# EAGLE board DCC-command-center-V2 (EAGLE 7.4.0)
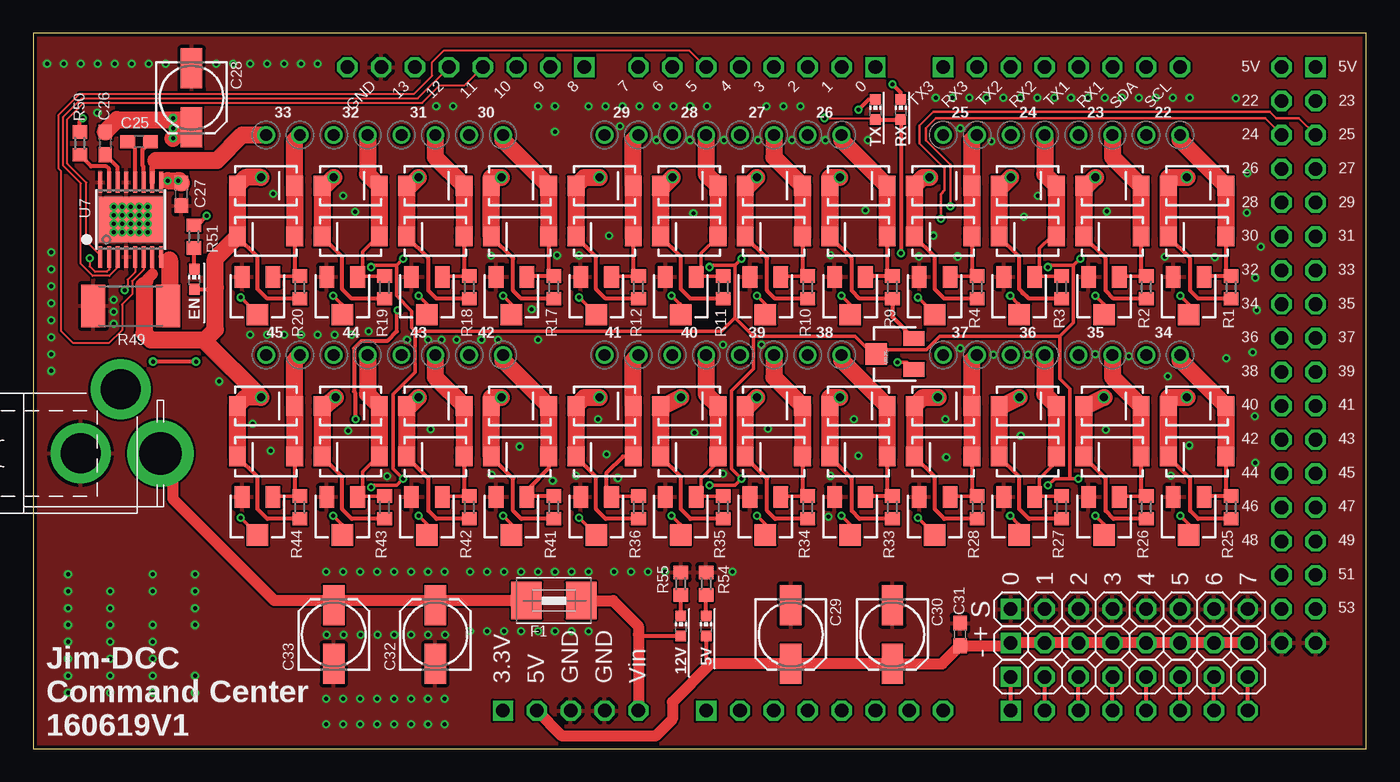
[diagram p3: board, top side]
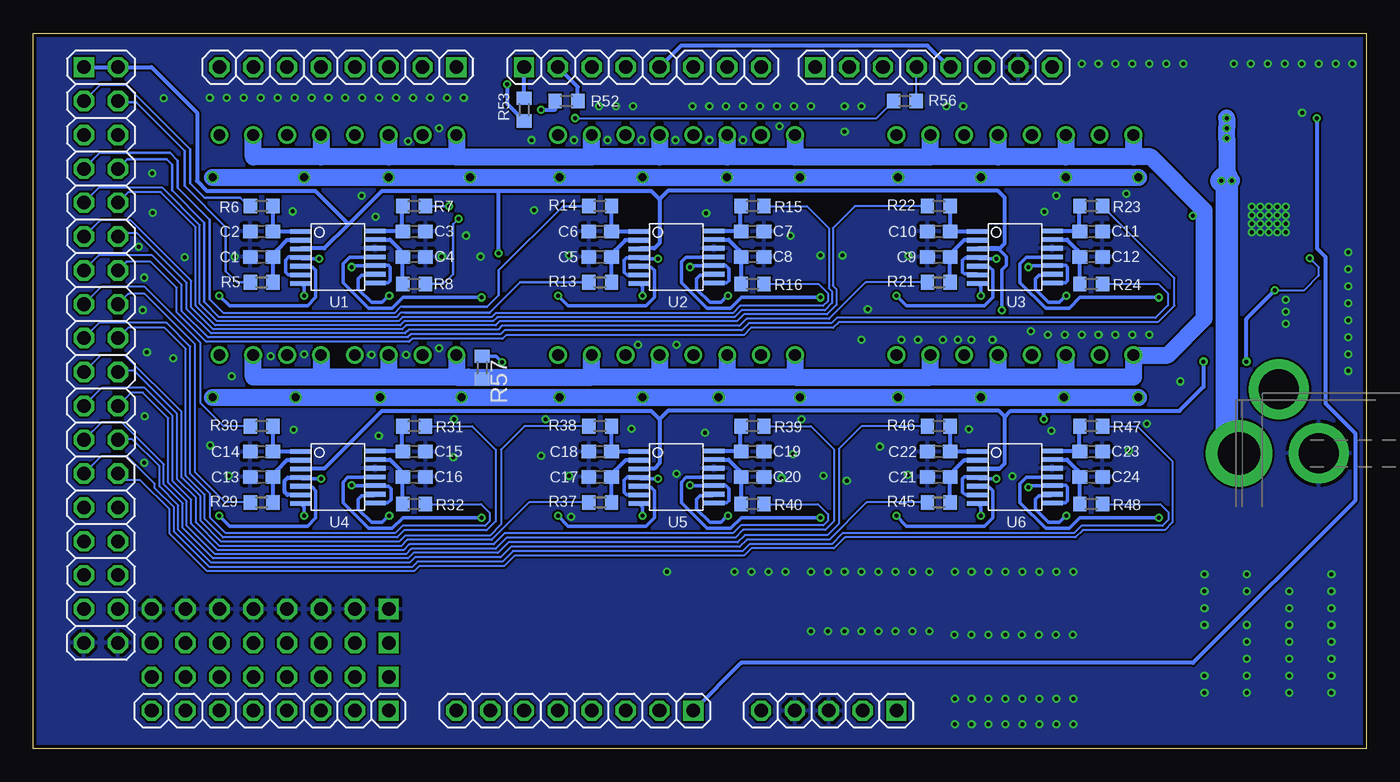
[diagram p4: board, bottom side, seen from below]

Size 100 x 53.65 mm. Coordinates in mm from the lower left corner, seen from the top.
Outline: 0,53.65 0,0 100,0 100,53.65 0,53.65
Copper layers (1*16): Top 0.035mm / dielectric 1.5mm / Bottom 0.035mm
Design rules "6mil": minimum track width 6mil, minimum drill 6mil, track to track 6mil, track to pad 6mil, pad to pad 6mil, via to via 6mil, smd to smd 6mil, copper to edge 10mil, drill to drill 8mil, minimum pad ring 6mil, minimum via ring 6mil, stop-mask expansion 4mil, vias tented up to drill 15mil, thermal gap 10mil

## Footprints (pad centres in the part's own frame; a part is rotated, then mirrored left to right if it is on the bottom)
C0603 = smd 1.1 x 1: 1 -0.85,0; 2 0.85,0
153CLV-0505 = smd 3 x 1.6: + 2.2,0; - -2.2,0
SMA-DIODE = smd 1.27 x 1.47: A -2.15,0; C 2.15,0
1812 = smd 2.286 x 2.794: 1 -2.046,0; 2 2.046,0
RAPC712 = drill 3 pad 4.5: 1 -3,0; 2 0,-4.8 | drill 3.2 pad 5: 3 3,0
1X02_PP_HOLES_ONLY = drill 0.889: 1 0,0; 2 2.54,0
2X18 = drill 1.016 square: 1 -21.59,-1.27 | drill 1.016 octagon: 2 -21.59,1.27; 3 -19.05,-1.27; 4 -19.05,1.27; 5 -16.51,-1.27; 6 -16.51,1.27; 7 -13.97,-1.27; 8 -13.97,1.27; 9 -11.43,-1.27; 10 -11.43,1.27; 11 -8.89,-1.27; 12 -8.89,1.27; 13 -6.35,-1.27; 14 -6.35,1.27; 15 -3.81,-1.27; 16 -3.81,1.27; 17 -1.27,-1.27; 18 -1.27,1.27; 19 1.27,-1.27; 20 1.27,1.27; 21 3.81,-1.27; 22 3.81,1.27; 23 6.35,-1.27; 24 6.35,1.27; 25 8.89,-1.27; 26 8.89,1.27; 27 11.43,-1.27; 28 11.43,1.27; 29 13.97,-1.27; 30 13.97,1.27; 31 16.51,-1.27; 32 16.51,1.27; 33 19.05,-1.27; 34 19.05,1.27; 35 21.59,-1.27; 36 21.59,1.27
1X08-S = drill 1.016 square: 1 -8.89,0 | drill 1.016 octagon: 2 -6.35,0; 3 -3.81,0; 4 -1.27,0; 5 1.27,0; 6 3.81,0; 7 6.35,0; 8 8.89,0
1X05-S = drill 1.016 square: 1 -5.08,0 | drill 1.016 octagon: 2 -2.54,0; 3 0,0; 4 2.54,0; 5 5.08,0
CHIP-LED0603 = smd 0.8 x 0.8: A 0,-0.75; C 0,0.75
R0603 = smd 1 x 1.1: 1 -0.85,0; 2 0.85,0
R2512 = smd 1.8 x 3.2: 1 -2.8,0; 2 2.8,0
TSSOP-14 = smd 1.6 x 0.35: 1 -2.8,1.9; 2 -2.8,1.25; 3 -2.8,0.6; 4 -2.8,-0.05; 5 -2.8,-0.7; 6 -2.8,-1.35; 7 -2.8,-2; 8 2.8,-1.95; 9 2.8,-1.3; 10 2.8,-0.65; 11 2.8,0; 12 2.8,0.65; 13 2.8,1.3; 14 2.8,1.95
HTSSOP16 = smd 0.3 x 1.6: P$1 -2.275,-2.8; P$2 -1.625,-2.8; P$3 -0.975,-2.8; P$4 -0.325,-2.8; P$5 0.325,-2.8; P$6 0.975,-2.8; P$7 1.625,-2.8; P$8 2.275,-2.8; P$9 2.275,2.8; P$10 1.625,2.8; P$11 0.975,2.8; P$12 0.325,2.8; P$13 -0.325,2.8; P$14 -0.975,2.8; P$15 -1.625,2.8; P$16 -2.275,2.8 | smd 5 x 3.4: P$17 0,0
TRIMPOT-3MM-2 = smd 1.092 x 1.6: 1 -1.155,-1.421; 3 1.155,-1.421 | smd 1.6 x 1.6: 2 0,1.421

## Placement (x,y rotation side)
C1  100P  [C0603]  82.87,36.88 180 bottom
C2  100P  [C0603]  82.87,38.79 180 bottom
C3  100P  [C0603]  71.44,38.79 0 bottom
C4  100P  [C0603]  71.44,36.88 0 bottom
C5  100P  [C0603]  57.46,36.88 180 bottom
C6  100P  [C0603]  57.46,38.79 180 bottom
C7  100P  [C0603]  46.03,38.79 0 bottom
C8  100P  [C0603]  46.03,36.88 0 bottom
C9  100P  [C0603]  32.06,36.88 180 bottom
C10  100P  [C0603]  32.06,38.79 180 bottom
C11  100P  [C0603]  20.63,38.79 0 bottom
C12  100P  [C0603]  20.63,36.88 0 bottom
C13  100P  [C0603]  82.87,20.37 180 bottom
C14  100P  [C0603]  82.87,22.28 180 bottom
C15  100P  [C0603]  71.44,22.28 0 bottom
C16  100P  [C0603]  71.44,20.37 0 bottom
C17  100P  [C0603]  57.46,20.37 180 bottom
C18  100P  [C0603]  57.46,22.28 180 bottom
C19  100P  [C0603]  46.03,22.28 0 bottom
C20  100P  [C0603]  46.03,20.37 0 bottom
C21  100P  [C0603]  32.06,20.37 180 bottom
C22  100P  [C0603]  32.06,22.28 180 bottom
C23  100P  [C0603]  20.63,22.28 0 bottom
C24  100P  [C0603]  20.63,20.37 0 bottom
C25  0.1uF  [C0603]  7.94,45.52 0 top
C26  0.1uF  [C0603]  5.39,45.39 90 top
C27  0.1uF  [C0603]  11.11,41.58 270 top
C28  100uF  [153CLV-0505]  11.87,48.82 270 top
C29  100uF  [153CLV-0505]  56.83,8.56 270 top
C30  100uF  [153CLV-0505]  64.45,8.56 270 top
C31  0.1uF  [C0603]  69.53,8.56 90 top
C32  100uF  [153CLV-0505]  30.16,8.56 90 top
C33  100uF  [153CLV-0505]  22.54,8.56 90 top
D1  SR240  [SMA-DIODE]  87.31,42.22 0 top
D2  SR240  [SMA-DIODE]  87.31,38.41 180 top
D3  SR240  [SMA-DIODE]  80.96,42.22 0 top
D4  SR240  [SMA-DIODE]  80.96,38.41 180 top
D5  SR240  [SMA-DIODE]  74.61,42.22 0 top
D6  SR240  [SMA-DIODE]  74.61,38.41 180 top
D7  SR240  [SMA-DIODE]  68.26,42.22 0 top
D8  SR240  [SMA-DIODE]  68.26,38.41 180 top
D9  SR240  [SMA-DIODE]  61.91,42.22 0 top
D10  SR240  [SMA-DIODE]  61.91,38.41 180 top
D11  SR240  [SMA-DIODE]  55.56,42.22 0 top
D12  SR240  [SMA-DIODE]  55.56,38.41 180 top
D13  SR240  [SMA-DIODE]  49.21,42.22 0 top
D14  SR240  [SMA-DIODE]  49.21,38.41 180 top
D15  SR240  [SMA-DIODE]  42.86,42.22 0 top
D16  SR240  [SMA-DIODE]  42.86,38.41 180 top
D17  SR240  [SMA-DIODE]  36.51,42.22 0 top
D18  SR240  [SMA-DIODE]  36.51,38.41 180 top
D19  SR240  [SMA-DIODE]  30.16,42.22 0 top
D20  SR240  [SMA-DIODE]  30.16,38.41 180 top
D21  SR240  [SMA-DIODE]  23.81,42.22 0 top
D22  SR240  [SMA-DIODE]  23.81,38.41 180 top
D23  SR240  [SMA-DIODE]  17.46,42.22 0 top
D24  SR240  [SMA-DIODE]  17.46,38.41 180 top
D25  SR240  [SMA-DIODE]  87.31,25.71 0 top
D26  SR240  [SMA-DIODE]  87.31,21.9 180 top
D27  SR240  [SMA-DIODE]  80.96,25.71 0 top
D28  SR240  [SMA-DIODE]  80.96,21.9 180 top
D29  SR240  [SMA-DIODE]  74.61,25.71 0 top
D30  SR240  [SMA-DIODE]  74.61,21.9 180 top
D31  SR240  [SMA-DIODE]  68.26,25.71 0 top
D32  SR240  [SMA-DIODE]  68.26,21.9 180 top
D33  SR240  [SMA-DIODE]  61.91,25.71 0 top
D34  SR240  [SMA-DIODE]  61.91,21.9 180 top
D35  SR240  [SMA-DIODE]  55.56,25.71 0 top
D36  SR240  [SMA-DIODE]  55.56,21.9 180 top
D37  SR240  [SMA-DIODE]  49.21,25.71 0 top
D38  SR240  [SMA-DIODE]  49.21,21.9 180 top
D39  SR240  [SMA-DIODE]  42.86,25.71 0 top
D40  SR240  [SMA-DIODE]  42.86,21.9 180 top
D41  SR240  [SMA-DIODE]  36.51,25.71 0 top
D42  SR240  [SMA-DIODE]  36.51,21.9 180 top
D43  SR240  [SMA-DIODE]  30.16,25.71 0 top
D44  SR240  [SMA-DIODE]  30.16,21.9 180 top
D45  SR240  [SMA-DIODE]  23.81,25.71 0 top
D46  SR240  [SMA-DIODE]  23.81,21.9 180 top
D47  SR240  [SMA-DIODE]  17.46,25.71 0 top
D48  SR240  [SMA-DIODE]  17.46,21.9 180 top
F1  [1812]  39.05,11.1 0 top
J1  [RAPC712]  6.54,22.15 180 bottom
JP1  M02POGO_PIN_HOLES_ONLY  [1X02_PP_HOLES_ONLY]  83.5,46.02 0 top
JP2  M02POGO_PIN_HOLES_ONLY  [1X02_PP_HOLES_ONLY]  78.42,46.02 0 top
JP3  M02POGO_PIN_HOLES_ONLY  [1X02_PP_HOLES_ONLY]  73.34,46.02 0 top
JP4  M02POGO_PIN_HOLES_ONLY  [1X02_PP_HOLES_ONLY]  68.26,46.02 0 top
JP5  M02POGO_PIN_HOLES_ONLY  [1X02_PP_HOLES_ONLY]  58.1,46.02 0 top
JP6  M02POGO_PIN_HOLES_ONLY  [1X02_PP_HOLES_ONLY]  53.02,46.02 0 top
JP7  M02POGO_PIN_HOLES_ONLY  [1X02_PP_HOLES_ONLY]  47.94,46.02 0 top
JP8  M02POGO_PIN_HOLES_ONLY  [1X02_PP_HOLES_ONLY]  42.86,46.02 0 top
JP9  M02POGO_PIN_HOLES_ONLY  [1X02_PP_HOLES_ONLY]  32.7,46.02 0 top
JP10  M02POGO_PIN_HOLES_ONLY  [1X02_PP_HOLES_ONLY]  27.62,46.02 0 top
JP11  M02POGO_PIN_HOLES_ONLY  [1X02_PP_HOLES_ONLY]  22.54,46.02 0 top
JP12  M02POGO_PIN_HOLES_ONLY  [1X02_PP_HOLES_ONLY]  17.46,46.02 0 top
JP13  M02POGO_PIN_HOLES_ONLY  [1X02_PP_HOLES_ONLY]  83.5,29.52 0 top
JP14  M02POGO_PIN_HOLES_ONLY  [1X02_PP_HOLES_ONLY]  78.42,29.52 0 top
JP15  M02POGO_PIN_HOLES_ONLY  [1X02_PP_HOLES_ONLY]  73.34,29.52 0 top
JP16  M02POGO_PIN_HOLES_ONLY  [1X02_PP_HOLES_ONLY]  68.26,29.52 0 top
JP17  M02POGO_PIN_HOLES_ONLY  [1X02_PP_HOLES_ONLY]  58.1,29.52 0 top
JP18  M02POGO_PIN_HOLES_ONLY  [1X02_PP_HOLES_ONLY]  53.02,29.52 0 top
JP19  M02POGO_PIN_HOLES_ONLY  [1X02_PP_HOLES_ONLY]  47.94,29.52 0 top
JP20  M02POGO_PIN_HOLES_ONLY  [1X02_PP_HOLES_ONLY]  42.86,29.52 0 top
JP21  M02POGO_PIN_HOLES_ONLY  [1X02_PP_HOLES_ONLY]  32.7,29.52 0 top
JP22  M02POGO_PIN_HOLES_ONLY  [1X02_PP_HOLES_ONLY]  27.62,29.52 0 top
JP23  M02POGO_PIN_HOLES_ONLY  [1X02_PP_HOLES_ONLY]  22.54,29.52 0 top
JP24  M02POGO_PIN_HOLES_ONLY  [1X02_PP_HOLES_ONLY]  17.46,29.52 0 top
JP25  [2X18]  94.93,29.52 270 bottom
JP26  [1X08-S]  32.45,51.11 0 bottom
JP27  [1X08-S]  54.29,51.11 0 bottom
JP28  [1X08-S]  77.15,51.11 180 bottom
JP29  [1X08-S]  59.37,2.84 180 bottom
JP30  [1X08-S]  82.23,2.84 180 bottom
JP31  [1X08-S]  82.23,5.38 0 top
JP32  [1X08-S]  82.23,7.93 0 top
JP33  [1X08-S]  82.23,10.46 0 top
JP34  [1X05-S]  40.32,2.84 180 bottom
LED1  [CHIP-LED0603]  12.08,35.2 0 top
LED2  [CHIP-LED0603]  63.18,47.93 0 top
LED3  [CHIP-LED0603]  65.09,47.93 0 top
LED4  [CHIP-LED0603]  50.48,9.2 0 top
LED5  [CHIP-LED0603]  48.58,9.2 0 top
R1  DNP  [R0603]  89.85,34.59 270 top
R2  DNP  [R0603]  83.5,34.59 270 top
R3  DNP  [R0603]  77.15,34.59 270 top
R4  DNP  [R0603]  70.8,34.59 270 top
R5  1K  [R0603]  82.87,34.98 0 bottom
R6  1K  [R0603]  82.87,40.69 0 bottom
R7  1K  [R0603]  71.44,40.69 180 bottom
R8  1K  [R0603]  71.44,34.85 180 bottom
R9  DNP  [R0603]  64.45,34.59 270 top
R10  DNP  [R0603]  58.1,34.59 270 top
R11  DNP  [R0603]  51.75,34.59 270 top
R12  DNP  [R0603]  45.4,34.59 270 top
R13  1K  [R0603]  57.46,34.98 0 bottom
R14  1K  [R0603]  57.46,40.69 0 bottom
R15  1K  [R0603]  46.03,40.69 180 bottom
R16  1K  [R0603]  46.03,34.85 180 bottom
R17  DNP  [R0603]  39.05,34.59 270 top
R18  DNP  [R0603]  32.7,34.59 270 top
R19  DNP  [R0603]  26.35,34.59 270 top
R20  DNP  [R0603]  20,34.59 270 top
R21  1K  [R0603]  32.06,34.98 0 bottom
R22  1K  [R0603]  32.06,40.69 0 bottom
R23  1K  [R0603]  20.63,40.69 180 bottom
R24  1K  [R0603]  20.63,34.85 180 bottom
R25  DNP  [R0603]  89.85,18.09 270 top
R26  DNP  [R0603]  83.5,18.09 270 top
R27  DNP  [R0603]  77.15,18.09 270 top
R28  DNP  [R0603]  70.8,18.09 270 top
R29  1K  [R0603]  82.87,18.47 0 bottom
R30  1K  [R0603]  82.87,24.18 0 bottom
R31  1K  [R0603]  71.44,24.18 180 bottom
R32  1K  [R0603]  71.44,18.34 180 bottom
R33  DNP  [R0603]  64.45,18.09 270 top
R34  DNP  [R0603]  58.1,18.09 270 top
R35  DNP  [R0603]  51.75,18.09 270 top
R36  DNP  [R0603]  45.4,18.09 270 top
R37  1K  [R0603]  57.46,18.47 0 bottom
R38  1K  [R0603]  57.46,24.18 0 bottom
R39  1K  [R0603]  46.03,24.18 180 bottom
R40  1K  [R0603]  46.03,18.34 180 bottom
R41  DNP  [R0603]  39.05,18.09 270 top
R42  DNP  [R0603]  32.7,18.09 270 top
R43  DNP  [R0603]  26.35,18.09 270 top
R44  DNP  [R0603]  20,18.09 270 top
R45  1K  [R0603]  32.06,18.47 0 bottom
R46  1K  [R0603]  32.06,24.18 0 bottom
R47  1K  [R0603]  20.63,24.18 180 bottom
R48  1K  [R0603]  20.63,18.34 180 bottom
R49  0.2R  [R2512]  7.3,33.2 0 top
R50  100K  [R0603]  3.49,45.39 270 top
R51  2K2  [R0603]  12.05,38.41 270 top
R52  1K5  [R0603]  60.01,48.57 180 bottom
R53  1K5  [R0603]  63.18,47.93 270 bottom
R54  1K5  [R0603]  50.48,12.37 270 top
R55  1K5  [R0603]  48.58,12.37 270 top
R56  100K  [R0603]  34.6,48.57 0 bottom
R57  100K  [R0603]  66.33,28.58 270 bottom
U1  LM339  [TSSOP-14]  77.15,36.88 0 bottom
U2  LM339  [TSSOP-14]  51.75,36.88 0 bottom
U3  LM339  [TSSOP-14]  26.35,36.88 0 bottom
U4  LM339  [TSSOP-14]  77.15,20.37 0 bottom
U5  LM339  [TSSOP-14]  51.75,20.37 0 bottom
U6  LM339  [TSSOP-14]  26.35,20.37 0 bottom
U7  DRV8801  [HTSSOP16]  7.3,39.68 0 top
VR1  10K  [TRIMPOT-3MM-2]  86.68,33.96 180 top
VR2  10K  [TRIMPOT-3MM-2]  80.33,33.96 180 top
VR3  10K  [TRIMPOT-3MM-2]  73.98,33.96 180 top
VR4  10K  [TRIMPOT-3MM-2]  67.62,33.96 180 top
VR5  10K  [TRIMPOT-3MM-2]  61.27,33.96 180 top
VR6  10K  [TRIMPOT-3MM-2]  54.92,33.96 180 top
VR7  10K  [TRIMPOT-3MM-2]  48.58,33.96 180 top
VR8  10K  [TRIMPOT-3MM-2]  42.23,33.96 180 top
VR9  10K  [TRIMPOT-3MM-2]  35.88,33.96 180 top
VR10  10K  [TRIMPOT-3MM-2]  29.52,33.96 180 top
VR11  10K  [TRIMPOT-3MM-2]  23.18,33.96 180 top
VR12  10K  [TRIMPOT-3MM-2]  16.82,33.96 180 top
VR13  10K  [TRIMPOT-3MM-2]  86.68,17.45 180 top
VR14  10K  [TRIMPOT-3MM-2]  80.33,17.45 180 top
VR15  10K  [TRIMPOT-3MM-2]  73.98,17.45 180 top
VR16  10K  [TRIMPOT-3MM-2]  67.62,17.45 180 top
VR17  10K  [TRIMPOT-3MM-2]  61.27,17.45 180 top
VR18  10K  [TRIMPOT-3MM-2]  54.92,17.45 180 top
VR19  10K  [TRIMPOT-3MM-2]  48.58,17.45 180 top
VR20  10K  [TRIMPOT-3MM-2]  42.23,17.45 180 top
VR21  10K  [TRIMPOT-3MM-2]  35.88,17.45 180 top
VR22  10K  [TRIMPOT-3MM-2]  29.52,17.45 180 top
VR23  10K  [TRIMPOT-3MM-2]  23.18,17.45 180 top
VR24  10K  [TRIMPOT-3MM-2]  16.82,17.45 180 top
VR25  10K  [TRIMPOT-3MM-2]  64.65,29.59 90 top

## Tracks (layer width: path | path; a pad name or v marks a point on that pad's centre or on a via)
0
  Bottom 0.305: R53.1 JP27.1
1
  Bottom 0.305: R52.1 59.16,49.62 JP27.2
5
  Top 0.152: U7.P$6 8.28,35.93 7.4,35.05 7.4,34.06 6.67,33.33 6.67,31.4 5.67,30.4 3.01,30.4 2.09,31.32 2.09,43.31 1.91,43.48 1.91,47.55 3.47,49.1 28.56,49.1 29.93,50.47 29.93,51.49 30.82,52.38 49.21,52.38 JP27.6
11
  Top 0.152: U7.P$1 5.02,37 3.97,38.05 3.97,42.44 2.55,43.87 2.55,47.22 3.77,48.44 29.17,48.44 30.46,49.73 32.34,49.73 JP26.4
  Bottom 0.152: 33.97,50.85 JP26.4 33.76,51.07 R56.2
12
  Top 0.152: U7.P$3 6.32,36.08 5.7,35.46 4.46,35.46 3.57,36.35 3.57,42.39 2.25,43.71 2.25,47.37 3.64,48.77 28.84,48.77 JP26.5
  Bottom 0.305: JP26.5 31.28,51.11 32.9,52.73 51.39,52.73 JP27.5
22
  Bottom 0.203: R5.1 84.72,34.98 85.56,35.81 85.56,39.12 88.66,42.22 88.66,44.83 92.29,48.46 93.56,48.46 JP25.4
23
  Bottom 0.203: R6.1 83.83,40.69 84.47,41.33 87.16,41.33 88.22,42.39 88.22,44.96 93.05,49.78 94.98,49.78 JP25.3
24  (via drill 0.3)
  Top 0.203: v68.79,40.67 68.79,43.79 66.97,45.62 66.97,46.51 67.73,47.27 92.42,47.27 JP25.6
  Bottom 0.203: R7.1 68.82,40.69 v68.79,40.67
25  (via drill 0.3)
  Top 0.203: v68.08,39.75 68.08,41.58 68.36,41.86 68.36,43.54 66.48,45.41 66.48,46.71 67.52,47.75 92.77,47.75 93.25,47.27 94.96,47.27 JP25.5
  Bottom 0.203: R8.1 69.25,34.85 68.51,35.59 68.51,39.32 v68.08,39.75
26
  Bottom 0.152: 72.12,32.69 72.43,32.69 72.76,32.36 86.04,32.36 87.18,33.5
  Bottom 0.203: R13.1 63.48,34.98 65.77,32.69 72.12,32.69 | 87.18,33.5 87.18,39.45 89.6,41.86 89.6,43.79 90,44.2 92.95,44.2 JP25.8
27
  Bottom 0.152: 72.27,33.15 72.43,33.15 72.91,32.66 85.74,32.66 86.78,33.71
  Bottom 0.203: R14.1 60.26,40.69 65.09,35.87 65.09,34.01 65.95,33.15 72.27,33.15 | 86.78,33.71 86.78,39.68 89.16,42.06 89.16,44.09 89.75,44.68 95.01,44.68 JP25.7
28
  Bottom 0.152: R15.1 41.97,40.69 40.32,39.04 40.32,34.54 40.07,34.29 40.07,33.43 40.62,32.87 46.87,32.87 47.38,32.36 65.19,32.36 65.49,32.05 72.17,32.05 72.48,31.75 86.35,31.75 87.82,33.22 87.82,39.12 90.43,41.73 92.87,41.73 JP25.10
29
  Bottom 0.152: R16.1 41.08,34.85 40.4,34.16 40.4,33.55 40.75,33.2 46.98,33.2 47.51,32.66 65.31,32.66 65.62,32.36 72.3,32.36 72.6,32.05 86.22,32.05 87.51,33.35 87.51,39.27 90.31,42.06 95.08,42.06 JP25.9
30
  Bottom 0.152: R21.1 37.55,34.98 40.3,32.23 46.49,32.23 47.03,31.7 64.86,31.7 65.14,31.42 71.82,31.42 72.1,31.14 86.65,31.14 88.48,32.97 88.48,34.93 92.21,38.66 93.41,38.66 JP25.12
31
  Bottom 0.152: R22.1 38.36,40.69 40.02,39.04 40.02,34.72 39.74,34.44 39.74,33.27 40.45,32.56 46.7,32.56 47.2,32.05 65.01,32.05 65.31,31.75 72.02,31.75 72.32,31.45 86.5,31.45 88.15,33.1 88.15,35.08 92.7,39.62 94.98,39.62 JP25.11
32
  Bottom 0.152: JP25.14 93,36.52 91.2,36.52 89.24,34.57 89.24,32.72 87.03,30.51 71.79,30.51 71.56,30.73 64.81,30.73 64.53,31.01 46.7,31.01 46.16,31.55 39.99,31.55 39.56,31.98 15.63,31.98 14.39,33.22 14.39,35.29 R23.1
33
  Bottom 0.152: R24.1 15.58,34.85 14.87,34.14 14.87,33.25 15.81,32.31 39.71,32.31 40.12,31.9 46.31,31.9 46.85,31.37 64.65,31.37 64.93,31.09 71.66,31.09 71.92,30.84 86.88,30.84 88.86,32.82 88.86,34.77 91.07,36.98 95.08,36.98 JP25.13
34
  Bottom 0.152: R29.1 85.61,18.47 87.87,20.73 87.87,30.33 91.65,34.11 92.87,34.11 JP25.16
35
  Bottom 0.152: R30.1 85.74,24.18 87.46,25.91 87.46,30.46 91.63,34.62 94.91,34.62 JP25.15
36
  Bottom 0.152: R31.1 67.07,24.18 65.31,22.43 65.31,17.04 66,16.36 72.2,16.36 72.71,15.85 85.76,15.85 87.13,17.22 87.13,19.05 88.56,20.47 88.56,29.97 90.16,31.57 92.87,31.57 JP25.18
37
  Bottom 0.152: R32.1 66.41,18.34 65.77,17.7 65.77,17.04 66.1,16.71 72.3,16.71 72.86,16.16 85.58,16.16 86.73,17.3 86.73,19.1 88.22,20.6 88.22,30.15 90,31.93 95.06,31.93 JP25.17
38
  Bottom 0.152: R37.1 62.8,18.47 65.62,15.65 71.94,15.65 72.4,15.19 86.02,15.19 87.79,16.97 87.79,18.8 89.22,20.22 89.22,25.12 92.44,28.35 93.56,28.35 JP25.20
39
  Bottom 0.152: R38.1 63.16,24.18 64.91,22.43 64.91,16.82 65.75,15.98 72.1,15.98 72.55,15.52 85.89,15.52 87.46,17.09 87.46,18.92 88.89,20.35 88.89,25.27 93.13,29.52 94.93,29.52 JP25.19
40
  Bottom 0.152: R39.1 41.67,24.18 39.94,22.45 39.94,17.04 40.57,16.41 46.75,16.41 47.33,15.82 64.48,15.82 65.31,14.99 71.64,14.99 72.05,14.58 86.35,14.58 88.48,16.71 88.48,18.54 89.88,19.94 89.88,24.79 91.78,26.7 92.67,26.7 JP25.22
41
  Bottom 0.152: R40.1 41.13,18.34 40.37,17.58 40.37,17.09 40.73,16.74 46.92,16.74 47.51,16.16 64.63,16.16 65.47,15.32 71.79,15.32 72.22,14.88 86.17,14.88 88.15,16.87 88.15,18.67 89.55,20.07 89.55,24.97 91.63,27.05 94.85,27.05 JP25.21
42
  Bottom 0.152: R45.1 37.48,18.47 40.27,15.67 46.47,15.67 47,15.14 64.17,15.14 64.96,14.35 71.36,14.35 71.77,13.95 86.65,13.95 89.11,16.41 89.11,18.24 90.54,19.66 90.54,21.16 92.59,23.22 93.61,23.22 JP25.24
43
  Bottom 0.152: R46.1 37.86,24.18 39.56,22.48 39.56,16.87 40.42,16 46.62,16 47.15,15.47 64.35,15.47 65.14,14.68 71.49,14.68 71.89,14.28 86.5,14.28 88.78,16.56 88.78,18.39 90.21,19.81 90.21,21.31 93.38,24.49 94.88,24.49 JP25.23
44
  Bottom 0.152: R47.1 17.18,24.18 14.54,21.54 14.54,16.97 15.12,16.38 21.27,16.38 21.8,15.85 39.1,15.85 39.94,15.01 46.14,15.01 46.67,14.48 63.89,14.48 64.68,13.69 71.05,13.69 71.44,13.31 86.95,13.31 89.77,16.13 89.77,17.93 91.98,20.14 93.18,20.14 JP25.26
45
  Bottom 0.152: R48.1 15.45,18.34 14.84,17.73 14.84,17.15 15.28,16.71 21.37,16.71 21.93,16.16 39.28,16.16 40.09,15.34 46.26,15.34 46.8,14.81 64.02,14.81 64.81,14.02 71.18,14.02 71.59,13.62 86.78,13.62 89.44,16.28 89.44,18.09 90.89,19.53 90.89,19.86 92.95,21.92 94.91,21.92 JP25.25
+5V
  Top 0.305: LED4.A 50.48,6.7 50.82,6.36
  Top 0.813: JP32.8 JP32.7 JP32.6 JP32.5 JP32.4 JP32.3 JP32.2 JP32.1 73.12,7.71 C31.1 68.18,6.36 C30.+ C29.+ 50.82,6.36 47.94,3.48 47.94,2.21 46.67,0.94 39.69,0.94 JP34.2
+12V  (via drill 0.3)
  Top 0.305: U7.P$9 10.1,42.48 v10.09,42.6 | C32.+ 30.16,11.1 | C33.+ 22.54,11.1
  Top 0.813: 30.16,11.1 22.54,11.1 18.09,11.1 10.47,18.72 10.47,19.99 8.57,21.9 9.29,21.9 J1.3 | F1.1 30.5,11.1 C32.+
  Top 1.27: C26.2 5.39,46.28 6.28,47.17 11.32,47.17 C28.+ 11.32,46.62 v10.47,45.77 | v10.09,42.6 v10.86,42.6 10.94,42.6 C27.1
  Bottom 1.27: 10.47,42.85 v10.09,42.6 | v10.47,47.3 v10.47,46.53 v10.47,45.77 10.47,42.98 v10.86,42.6
  Bottom 1.676: J1.3 9.54,22.23 10.47,23.17 10.47,42.85 10.6,42.85 v10.86,42.6
+12VR
  Top 0.305: LED5.A 45.52,8.45 45.4,8.56
  Top 0.813: F1.2 43.49,11.1 45.4,9.2 45.4,8.56 JP34.5
A0  (via drill 0.3)
  Top 0.305: R50.1 3.49,47.07 v3.69,47.27
  Bottom 0.305: v3.69,47.27 3.69,37.52 3.06,36.88 3.06,25.88 0.82,23.65 0.82,18.59 12.99,6.43 46.9,6.43 JP29.1
COM+  (via drill 0.6)
  Top 0.254: 74.18,34.16 74.55,33.9
  Top 0.305: R1.2 87.4,33.75 86.8,34.34 86.8,36.76 D2.C | D4.C 80.45,36.76 80.45,34.34 81.05,33.75 R2.2 | D6.C 73.98,36.89 73.98,34.47 74.55,33.9 74.7,33.75 R3.2 | D8.C 67.62,36.89 67.62,34.47 68.35,33.75 R4.2 | D10.C 61.4,36.76 61.4,34.34 62,33.75 R9.2 64.45,32.37 VR25.3 | D12.C 55.05,36.76 55.05,34.34 55.65,33.75 R10.2 | D14.C 48.58,36.89 48.58,34.47 49.3,33.75 R11.2 | D16.C 42.23,36.89 42.23,34.47 42.95,33.75 R12.2 | R17.2 36.6,33.75 36,34.34 36,36.76 D18.C | D20.C 29.65,36.76 29.65,34.34 30.25,33.75 R18.2 | D22.C 23.18,36.89 23.18,34.47 23.9,33.75 R19.2 | D24.C 16.82,36.89 16.82,34.47 17.55,33.75 R20.2 | R25.2 87.4,17.24 86.8,17.83 86.8,20.25 D26.C | D28.C 80.45,20.25 80.45,17.83 81.05,17.24 R26.2 | D30.C 73.98,20.38 73.98,17.96 74.7,17.24 R27.2 | D32.C 67.62,20.38 67.62,17.96 68.35,17.24 R28.2 | R33.2 62,17.24 61.4,17.83 61.4,20.25 D34.C | D36.C 55.05,20.25 55.05,17.83 55.65,17.24 R34.2 | D38.C 48.58,20.38 48.58,17.96 49.3,17.24 R35.2 | D40.C 42.23,20.38 42.23,17.96 42.95,17.24 R36.2 | R41.2 36.6,17.24 36,17.83 36,20.25 D42.C | D44.C 29.65,20.25 29.65,17.83 30.25,17.24 R42.2 | D46.C 23.18,20.38 23.18,17.96 23.9,17.24 R43.2 | D48.C 16.82,20.38 16.82,17.96 17.55,17.24 R44.2 | U7.P$7 8.92,35.59 | LED1.A 13.51,34.45 13.65,34.59
  Top 0.813: 8.92,35.59 8.57,35.23 8.57,34.98 8.32,34.72
  Top 1.27: D1.A D2.C 85.16,42.85 v86.55,42.85 | D4.C D3.A 79.06,42.22 v79.69,42.85 | D6.C D5.A 72.71,42.22 v73.34,42.85 | D8.C D7.A 66.75,42.85 v67.24,42.85 | D9.A D10.C 59.76,42.85 v60.51,42.85 | D12.C D11.A 53.66,42.22 v54.29,42.85 | D14.C D13.A 47.3,42.22 v47.94,42.85 | D16.C D15.A 41.34,42.85 v42.48,42.85 | D17.A D18.C 34.36,42.85 v35.11,42.85 | D20.C D19.A 28.25,42.22 v28.89,42.85 | D22.C D21.A 21.91,42.22 v22.54,42.85 | v17.08,42.85 15.95,42.85 D23.A D24.C 13.65,36.75 13.65,34.59 13.65,31.42 12.89,30.66 12.76,30.66 | D25.A D26.C 85.16,26.34 v86.55,26.34 | D28.C D27.A 79.06,25.71 v80.33,26.34 | D30.C D29.A 72.71,25.71 v73.98,26.34 | D32.C D31.A 66.75,26.34 v67.88,26.34 | D33.A D34.C 59.76,26.34 v60.51,26.34 | D36.C D35.A 53.66,25.71 v54.29,26.34 | D38.C D37.A 47.3,25.71 v48.58,26.34 | D40.C D39.A 41.34,26.34 v42.48,26.34 | D41.A D42.C 34.36,26.34 v35.11,26.34 | D44.C D43.A 28.25,25.71 v28.89,26.34 | D46.C D45.A 21.91,25.71 v22.67,26.34 | D48.C D47.A 15.95,26.34 v17.08,26.34 12.76,30.66 | 8.32,34.72 8.32,31.17 8.82,30.66 12.76,30.66
  Bottom 1.27: v86.55,42.85 v79.69,42.85 v73.34,42.85 v67.24,42.85 v60.51,42.85 v54.29,42.85 v47.94,42.85 v42.48,42.85 v35.11,42.85 v28.89,42.85 v22.54,42.85 v17.08,42.85 | v86.55,26.34 v80.33,26.34 v73.98,26.34 v67.88,26.34 v60.51,26.34 v54.29,26.34 v48.58,26.34 v42.48,26.34 v35.11,26.34 v28.89,26.34 v22.67,26.34 v17.08,26.34
COM-  (via drill 0.3)
  Top 0.305: R51.1 12.32,39.26 v13.02,39.95
  Top 0.406: U7.P$10 8.92,43.84 9.21,44.12
  Top 1.27: 9.21,44.12 13.78,44.12 15.68,46.02 JP12.1
  Bottom 0.254: R57.2 67.23,27.73 67.37,27.86
  Bottom 0.305: v13.02,39.95 12.74,39.95 12.24,40.45
  Bottom 1.27: 68.26,44.37 73.34,44.37 | 73.34,44.37 78.42,44.37 | 78.42,44.37 83.5,44.37 JP1.1 | JP2.1 78.42,44.37 | JP3.1 73.34,44.37 | 42.86,44.37 47.94,44.37 | 47.94,44.37 53.02,44.37 | 53.02,44.37 58.1,44.37 | 58.1,44.37 JP5.1 | JP6.1 53.02,44.37 | JP7.1 47.94,44.37 | JP12.1 17.46,44.37 | 17.46,44.37 22.54,44.37 | 22.54,44.37 27.62,44.37 | 27.62,44.37 32.7,44.37 | 32.7,44.37 JP9.1 | JP10.1 27.62,44.37 | JP11.1 22.54,44.37 | JP4.1 68.26,44.37 | 68.26,44.37 58.1,44.37 | JP8.1 42.86,44.37 | 42.86,44.37 32.7,44.37 | 68.26,27.86 73.34,27.86 | 73.34,27.86 78.42,27.86 | 78.42,27.86 83.5,27.86 JP13.1 | JP14.1 78.42,27.86 | JP15.1 73.34,27.86 | 42.86,27.86 47.94,27.86 | 47.94,27.86 53.02,27.86 | 53.02,27.86 58.1,27.86 | 58.1,27.86 JP17.1 | JP18.1 53.02,27.86 | JP19.1 47.94,27.86 | 22.54,27.86 17.46,27.86 JP24.1 14.89,29.52 12.15,32.26 12.15,40.36 12.24,40.45 16.16,44.37 17.46,44.37 | 22.54,27.86 27.62,27.86 | 27.62,27.86 32.7,27.86 | 32.7,27.86 JP21.1 | JP22.1 27.62,27.86 | JP23.1 22.54,27.86 | JP16.1 68.26,27.86 | 68.26,27.86 67.37,27.86 58.1,27.86 | JP20.1 42.86,27.86 | 42.86,27.86 32.7,27.86
GND  (via drill 0.3)
  other vias: 84.9,36.88 67.52,38.48 69.35,36.91 69.56,46.53 74.31,39.9 75.37,41.48 80.53,40.28 59.8,37.01 49.51,40.16 43.19,38.46 40.95,36.98 39.3,36.98 34.35,36.96 37.4,32.94 37.86,30.66 34.88,30.66 33.61,30.66 31.76,30.66 30.62,30.66 29.63,30.66 28.03,30.66 24.14,40.26 23.25,41.48 17.99,41.61 85.13,27.94 91.04,40.18 91.07,43.15 92.09,37.64 91.68,35.33 91.81,32.89 91.48,29.72 91.65,24.92 91.68,21.44 82.2,29.41 79.69,29.59 89.49,29.29 74.64,29.54 72.04,29.54 69.56,30.02 68.44,24.71 55.1,24 68.49,21.84 74.08,23.47 59.8,20.45 59.65,17.4 51.75,20.6 51.75,30.28 61.91,21.97 61.58,24.71 43.85,20.29 43.01,22.07 42.38,24.71 29.8,23.95 36.48,22.66 34.38,20.52 40.73,20.47 38.97,20.09 23.63,23.83 17.79,22.33 16.47,24.36 80.48,23.9 86.73,22.73 85.33,20.47 90.21,48.77 88.63,36.86 13.93,27.53 30.87,3.73 29.6,3.73 28.33,3.73 27.06,3.73 25.79,3.73 24.52,3.73 23.25,3.73 21.98,3.73 30.87,1.83 29.6,1.83 28.33,1.83 27.06,1.83 25.79,1.83 24.52,1.83 23.25,1.83 21.98,1.83 41.67,8.81 40.4,8.81 39.13,8.81 37.86,8.81 36.59,8.81 35.32,8.81 34.05,8.81 32.78,8.81 30.9,8.53 29.63,8.53 28.36,8.53 27.09,8.53 25.82,8.53 24.55,8.53 23.28,8.53 22.01,8.53 30.87,13.26 29.6,13.26 28.33,13.26 27.06,13.26 25.79,13.26 24.52,13.26 23.25,13.26 21.98,13.26 41.67,13.26 40.4,13.26 39.13,13.26 37.86,13.26 36.59,13.26 35.32,13.26 34.05,13.26 32.78,13.26 52.46,13.26 47.38,13.26 46.11,13.26 44.84,13.26 43.57,13.26 12.13,13.08 12.13,11.81 12.13,10.54 12.13,9.27 12.13,5.46 12.13,4.19 8.95,13.08 8.95,11.81 8.95,9.27 8.95,8 8.95,6.73 8.95,5.46 8.95,4.19 5.78,11.81 5.78,10.54 5.78,9.27 5.78,8 5.78,6.73 5.78,5.46 5.78,4.19 2.6,13.08 2.6,11.81 2.6,10.54 2.6,9.27 2.6,8 2.6,6.73 2.6,5.46 2.6,4.19 1.33,37.21 1.33,35.94 1.33,34.67 1.33,33.4 1.33,32.13 1.33,30.86 1.33,29.59 1.33,28.32 9.92,51.36 8.65,51.36 7.38,51.36 6.11,51.36 4.84,51.36 3.57,51.36 2.3,51.36 1.03,51.36 21.35,51.36 20.08,51.36 18.81,51.36 17.54,51.36 16.27,51.36 15,51.36 13.73,51.36 39.13,48.18 37.86,48.18 31.51,48.18 30.24,48.18 50.56,48.18 49.29,48.18 48.02,48.18 46.75,48.18 45.48,48.18 44.21,48.18 42.94,48.18 41.67,48.18 57.54,48.18 56.27,48.18 55,48.18 76.59,48.82 75.32,48.82 74.05,48.82 72.78,48.82 71.51,48.82 70.24,48.82 68.97,48.82 67.7,48.82 86.75,48.82 85.48,48.82 84.21,48.82 82.94,48.82 81.67,48.82 80.4,48.82 79.13,48.82 77.86,48.82 25.16,31.29 23.89,31.04 22.62,31.04 21.35,31.04 20.08,31.04 18.81,31.04 17.54,31.04 16.27,31.04 62.44,40.39 6.03,40.64 6.67,40.64 7.3,40.64 7.94,40.64 8.57,40.64 6.03,40.01 6.67,40.01 7.3,40.01 7.94,40.01 8.57,40.01 6.03,39.37 6.67,39.37 7.3,39.37 7.94,39.37 8.57,39.37 6.03,38.74 6.67,38.74 7.3,38.74 7.94,38.74 8.57,38.74 62.62,45.64 59.45,45.64 56.91,45.64 54.37,45.64 51.83,45.64 49.29,45.64 46.75,45.64 44.03,46.69 39.13,46.28 4.81,47.7 26.55,20.42 54.65,30.28 66.43,36.91 71.89,45.54 49.59,23.67 6.03,33.66 6.03,32.77 6.03,31.88
  pour Top: 107.63,68.89 107.63,-72.08 -10.48,-72.08 -10.48,68.89
  pour Bottom: 111.44,73.97 111.44,-79.7 -20.64,-79.7 -20.64,73.97
JP1
  Top 0.305: D2.A 89.46,35.84 R1.1 87.89,35.45 VR1.1
  Top 1.27: D2.A D1.C 86.04,45.64 JP1.2
JP2
  Top 0.254: 83.11,35.84 R2.1 81.54,35.45
  Top 0.305: D4.A 83.11,35.84 | 81.54,35.45 VR2.1
  Top 1.27: D4.A D3.C 80.96,44.37 JP2.2
JP3
  Top 0.254: 75.19,35.45 R3.1 | D6.A 76.39,38.41 75.5,37.52 75.5,35.75 VR3.1
  Top 0.305: VR3.1 75.19,35.45
  Top 1.27: D6.A D5.C 75.88,43.09 JP3.2
JP4
  Top 0.254: 70.41,35.84 R4.1 68.84,35.45
  Top 0.305: D8.A 70.41,35.84 | 68.84,35.45 VR4.1
  Top 1.27: D8.A D7.C 70.41,45.64 JP4.2
JP5
  Top 0.305: D10.A 64.06,35.84 R9.1 62.49,35.45 VR5.1
  Top 1.27: D10.A D9.C 60.64,45.64 JP5.2
JP6
  Top 0.254: 57.71,35.84 R10.1 56.14,35.45
  Top 0.305: D12.A 57.71,35.84 | 56.14,35.45 VR6.1
  Top 1.27: D12.A D11.C 55.56,44.37 JP6.2
JP7
  Top 0.254: 49.79,35.45 R11.1 | D14.A 50.1,37.14 50.1,35.75 VR7.1
  Top 0.305: VR7.1 49.79,35.45
  Top 1.27: D14.A D13.C 50.48,43.09 JP7.2
JP8
  Top 0.254: 45.01,35.84 R12.1 43.44,35.45
  Top 0.305: D16.A 45.01,35.84 | 43.44,35.45 VR8.1
  Top 1.27: D16.A D15.C 45.01,45.64 JP8.2
JP9
  Top 0.305: D18.A 38.66,35.84 R17.1 37.09,35.45 VR9.1
  Top 1.27: D18.A D17.C 35.24,45.64 JP9.2
JP10
  Top 0.254: 32.31,35.84 R18.1 30.74,35.45
  Top 0.305: D20.A 32.31,35.84 | 30.74,35.45 VR10.1
  Top 1.27: D20.A D19.C 30.16,44.37 JP10.2
JP11
  Top 0.254: 24.39,35.45 R19.1 | D22.A 25.84,38.41 24.7,37.26 24.7,35.75 VR11.1
  Top 0.305: VR11.1 24.39,35.45
  Top 1.27: D22.A D21.C 25.08,43.09 JP11.2
JP12
  Top 0.254: 19.61,35.84 R20.1 18.04,35.45
  Top 0.305: D24.A 19.61,35.84 | 18.04,35.45 VR12.1
  Top 1.27: D24.A D23.C 19.61,45.64 JP12.2
JP13
  Top 0.305: D26.A 89.46,19.33 R25.1 87.89,18.94 VR13.1
  Top 1.27: D26.A D25.C 86.04,29.12 JP13.2
JP14
  Top 0.254: 83.11,19.33 R26.1 81.54,18.94
  Top 0.305: D28.A 83.11,19.33 | 81.54,18.94 VR14.1
  Top 1.27: D28.A D27.C 80.96,27.86 JP14.2
JP15
  Top 0.254: 75.19,18.94 R27.1 | D30.A 76.76,21.51 75.5,20.24 75.5,19.24 VR15.1
  Top 0.305: VR15.1 75.19,18.94
  Top 1.27: D30.A D29.C 75.88,26.59 JP15.2
JP16
  Top 0.254: 70.41,19.33 R28.1 68.84,18.94
  Top 0.305: D32.A 70.41,19.33 | 68.84,18.94 VR16.1
  Top 1.27: D32.A D31.C 70.41,29.12 JP16.2
JP17
  Top 0.305: D34.A 64.06,19.33 R33.1 62.49,18.94 VR17.1
  Top 1.27: D34.A D33.C 60.64,29.12 JP17.2
JP18
  Top 0.254: 57.71,19.33 R34.1 56.14,18.94
  Top 0.305: D36.A 57.71,19.33 | 56.14,18.94 VR18.1
  Top 1.27: D36.A D35.C 55.56,27.86 JP18.2
JP19
  Top 0.254: 49.79,18.94 R35.1 | D38.A 51.36,21.51 50.1,20.24 50.1,19.24 VR19.1
  Top 0.305: VR19.1 49.79,18.94
  Top 1.27: D38.A D37.C 50.48,26.59 JP19.2
JP20
  Top 0.254: 43.44,18.94 R36.1
  Top 0.305: 43.44,18.94 VR20.1 42.99,19.26 42.99,20.65 44.23,21.9 D40.A
  Top 1.27: D40.A D39.C 45.01,29.12 JP20.2
JP21
  Top 0.305: R41.1 37.09,18.94 VR21.1 37.15,18.99 37.15,19.51 38.66,21.02 D42.A
  Top 1.27: D42.A D41.C 35.24,29.12 JP21.2
JP22
  Top 0.254: 32.31,19.33 R42.1 30.74,18.94
  Top 0.305: D44.A 32.31,19.33 | 30.74,18.94 VR22.1
  Top 1.27: D44.A D43.C 30.16,27.86 JP22.2
JP23
  Top 0.254: 24.39,18.94 R43.1 | D46.A 25.84,21.9 24.7,20.75 24.7,19.24 VR23.1
  Top 0.305: VR23.1 24.39,18.94
  Top 1.27: D46.A D45.C 25.08,26.59 JP23.2
JP24
  Top 0.254: 19.61,19.33 R44.1 18.04,18.94
  Top 0.305: D48.A 19.61,19.33 | 18.04,18.94 VR24.1
  Top 1.27: D48.A D47.C 19.61,29.12 JP24.2
N$1
  Top 0.305: JP30.1 JP31.1
N$2
  Top 0.305: JP30.2 JP31.2
N$3
  Top 0.305: JP30.3 JP31.3
N$4
  Top 0.305: JP30.4 JP31.4
N$5
  Top 0.305: JP30.5 JP31.5
N$6
  Top 0.305: JP30.6 JP31.6 86.04,6.02
N$7
  Top 0.305: JP30.7 JP31.7
N$8
  Top 0.305: JP30.8 JP31.8
N$9
  Top 0.406: U7.P$8 9.97,36.88 10.22,36.63
  Top 1.27: 10.22,36.63 10.22,33.32 R49.2
N$10
  Top 0.305: U7.P$12 7.62,44.98 C25.1
N$11
  Top 0.305: U7.P$11 8.28,43.65 8.19,43.74 8.19,44.92 C25.2
N$12
  Top 0.305: U7.P$14 6.32,43.61 C26.1
N$13  (via drill 0.3)
  Top 0.254: v64.83,28.98 65.53,28.98 VR25.1
  Bottom 0.254: R57.1 65.28,29.43 v64.83,28.98
N$14
  Top 0.305: U7.P$15 5.67,43.48 5.47,43.66 4.34,43.66 R50.2
N$15
  Top 0.305: R51.2 12.05,35.98 LED1.C
N$16  (via drill 0.3)
  Top 0.305: LED2.C 62.66,48.68 v61.91,47.93
  Bottom 0.305: v61.91,47.93 60.85,47.93 R52.2
N$17  (via drill 0.3)
  Top 0.305: LED3.C 65.09,49.2 v64.45,49.84
  Bottom 0.305: v64.45,49.84 64.45,48.35 R53.2
N$18
  Top 0.305: LED4.C R54.2
N$19
  Top 0.305: LED5.C R55.2
OP1
  Bottom 0.305: U1.2 80.98,38.13 81.72,37.39 81.72,37.17 C1.1 R5.2
OP2
  Bottom 0.305: U1.1 C2.1 | C2.1 | C2.1 R6.2
OP3
  Bottom 0.305: U1.14 72.33,38.83 | 72.33,38.83 C3.1 | 72.33,38.83 72.33,40.65 R7.2
OP4
  Bottom 0.305: U1.13 73.24,38.18 72.45,37.39 72.45,37.05 C4.1 R8.2
OP5
  Bottom 0.305: U2.2 55.58,38.13 56.32,37.39 56.32,37.17 C5.1 R13.2
OP6
  Bottom 0.305: U2.1 C6.1 | C6.1 | C6.1 R14.2
OP7
  Bottom 0.305: U2.14 46.93,38.83 | 46.93,38.83 C7.1 | 46.93,38.83 46.93,40.65 R15.2
OP8
  Bottom 0.305: U2.13 47.84,38.18 47.05,37.39 47.05,37.05 C8.1 R16.2
OP9
  Bottom 0.305: U3.2 30.18,38.13 30.92,37.39 30.92,37.17 C9.1 R21.2
OP10
  Bottom 0.305: U3.1 C10.1 | C10.1 | C10.1 R22.2
OP11
  Bottom 0.305: U3.14 21.53,38.83 | 21.53,38.83 C11.1 | 21.53,38.83 21.53,40.65 R23.2
OP12
  Bottom 0.305: U3.13 22.44,38.18 21.65,37.39 21.65,37.05 C12.1 R24.2
OP13
  Bottom 0.305: U4.2 80.98,21.62 81.72,20.88 81.72,20.66 C13.1 R29.2
OP14
  Bottom 0.305: U4.1 C14.1 | C14.1 | C14.1 R30.2
OP15
  Bottom 0.305: U4.14 72.33,22.32 | 72.33,22.32 C15.1 | 72.33,22.32 72.33,24.14 R31.2
OP16
  Bottom 0.305: U4.13 73.24,21.67 72.45,20.88 72.45,20.54 C16.1 R32.2
OP17
  Bottom 0.305: U5.2 55.58,21.62 56.32,20.88 56.32,20.66 C17.1 R37.2
OP18
  Bottom 0.305: U5.1 C18.1 | C18.1 | C18.1 R38.2
OP19
  Bottom 0.305: U5.14 46.93,22.32 | 46.93,22.32 C19.1 | 46.93,22.32 46.93,24.14 R39.2
OP20
  Bottom 0.305: U5.13 47.84,21.67 47.05,20.88 47.05,20.54 C20.1 R40.2
OP21
  Bottom 0.305: U6.2 30.18,21.62 30.92,20.88 30.92,20.66 C21.1 R45.2
OP22
  Bottom 0.305: U6.1 C22.1 | C22.1 | C22.1 R46.2
OP23
  Bottom 0.305: U6.14 21.53,22.32 | 21.53,22.32 C23.1 | 21.53,22.32 21.53,24.14 R47.2
OP24
  Bottom 0.305: U6.13 22.44,21.67 21.65,20.88 21.65,20.54 C24.1 R48.2
REF  (via drill 0.3)
  Top 0.254: v76.13,19.74 76.64,20.24 77.91,20.24 | 77.91,20.24 v78.42,20.24 | v50.73,19.74 52.64,19.74 v53.15,20.24 52.38,21.01 52.38,26.85 54.04,28.5 54.04,30.91 | v25.33,19.61 25.46,19.74 27.24,19.74 v27.75,20.24 26.98,21.01 26.98,26.59 28.64,28.25 28.64,31.29 | v76.13,36.12 76.26,36.25 78.04,36.25 | v50.73,36.12 50.86,36.25 52.64,36.25 | 52.64,36.25 v53.15,36.75 | v25.33,36.12 25.46,36.25 27.24,36.25 | 78.04,36.25 78.04,31.93 77.02,30.91 | 77.02,30.91 68.01,30.91 66.99,29.9 63.54,29.9 VR25.2 62.98,29.59 61.66,30.91 54.04,30.91 | 78.04,36.25 v78.55,36.75 | 54.04,30.91 52.64,32.31 | 52.64,32.31 52.64,36.25 | 27.24,36.25 27.24,33.96 28.38,32.82 28.38,31.55 28.64,31.29 | 28.64,31.29 51.62,31.29 52.64,32.31 | 27.24,36.25 v27.75,36.75 | 77.02,30.91 77.02,27.74 77.79,26.98 77.79,20.37 77.91,20.24
  Bottom 0.254: U4.8 73.41,18.42 73.16,18.67 73.16,19.51 73.34,19.69 74.31,19.69 U4.10 76.12,19.72 v76.13,19.74 | v78.42,20.24 79.87,20.24 U4.4 | U5.6 55.48,19.02 55.69,19.23 55.69,20.12 55.43,20.37 54.6,20.37 U5.4 54.47,20.24 v53.15,20.24 | U5.8 47.98,18.42 47.81,18.59 47.81,19.48 48.07,19.74 48.94,19.74 U5.10 50.72,19.72 v50.73,19.74 | U6.8 22.59,18.42 22.41,18.59 22.41,19.61 22.54,19.74 23.54,19.74 U6.10 25.22,19.72 v25.33,19.61 | U6.6 30.08,19.02 30.29,19.23 30.29,20.24 30.16,20.37 29.2,20.37 U6.4 29.07,20.24 v27.75,20.24 | U1.8 73.39,34.93 73.21,35.1 73.21,36.12 73.34,36.25 74.34,36.25 U1.10 76.02,36.23 v76.13,36.12 | U1.6 80.88,35.53 81.09,35.74 81.09,36.63 80.83,36.88 80,36.88 U1.4 79.87,36.75 v78.55,36.75 | U2.6 54.6,35.48 55.43,35.48 55.69,35.74 55.69,36.63 55.48,36.83 U2.4 54.47,36.75 v53.15,36.75 | U2.8 47.98,34.93 47.81,35.1 47.81,35.99 48.07,36.25 48.94,36.25 U2.10 50.62,36.23 v50.73,36.12 | U3.6 29.23,35.61 30.16,35.61 30.29,35.74 30.29,36.63 30.08,36.83 U3.4 29.07,36.75 v27.75,36.75 | U3.8 22.59,34.93 22.41,35.1 22.41,36.12 22.54,36.25 23.54,36.25 U3.10 25.22,36.23 v25.33,36.12
  Bottom 0.305: U4.6 80.93,19.02 81.14,19.23 81.14,20.09 80.91,20.32 U4.4
VCC  (via drill 0.3)
  Top 0.152: U7.P$2 5.67,35.92 5.52,35.76 4.63,35.76 4.23,36.17 v4.23,36.78 | U7.P$5 7.62,35.73 7.07,35.18 7.07,34.59 v6.84,34.37 | v59.37,47.3 63.06,47.3 LED2.A
  Top 0.254: 27.26,31.29 27.26,32.82 v27.32,32.87
  Top 0.305: 27.26,31.29 26.53,30.56 24.6,30.56 24.06,30.02 24.06,26.77 24.14,26.7 24.14,24.74 v24.19,24.69 | v12.2,29.03 v8.98,29.03 | LED2.A LED3.A v65.09,37.14
  Bottom 0.152: v4.23,36.78 3.54,36.09 3.54,35.48 4.66,34.37 v6.84,34.37 | v59.37,47.3 36.73,47.3 R56.1
  Bottom 0.254: v27.32,32.87 27.32,35.92 26.98,36.25 26.98,36.88 27.53,37.42
  Bottom 0.305: U1.3 79.92,37.52 78.17,37.52 76.35,39.33 | 27.62,37.52 29.11,37.52 U3.3 27.53,37.48 | 76.35,39.33 73.85,41.83 65.09,41.83 | 65.09,41.83 53.66,41.83 53.02,41.2 | 53.02,41.2 53.02,37.9 53.4,37.52 54.52,37.52 U2.3 | 27.53,37.48 27.11,37.9 27.11,41.33 27.62,41.83 52.38,41.83 53.02,41.2 | U4.3 79.92,21.01 78.17,21.01 73.85,25.32 53.66,25.32 53.02,24.69 | 27.62,21.01 29.11,21.01 U6.3 27.53,20.97 27.11,21.39 27.11,24.89 | 53.02,24.69 53.02,21.39 53.4,21.01 54.52,21.01 U5.3 | 53.02,24.69 52.38,25.32 27.54,25.32 27.11,24.89 | 27.53,37.48 27.53,37.42 | JP25.1 JP25.2 91.12,51.11 87.72,47.7 87.72,42.57 86.98,41.83 78.85,41.83 76.35,39.33 | 27.11,24.89 26.68,25.32 24.19,25.32 | 24.19,25.32 14.01,25.32 12.2,27.13 v12.2,29.03 | v8.98,29.03 8.98,32.23 v6.84,34.37 | v65.09,37.14 65.09,41.83 | v24.19,24.69 24.19,25.32
VR1  (via drill 0.3)
  Top 0.254: VR1.2 86.68,33.33 v86.04,33.96
  Bottom 0.254: U1.5 79.89,36.12 79.06,36.12 78.8,35.87 78.8,33.83 79.44,33.2 85.28,33.2 v86.04,33.96
VR2  (via drill 0.3)
  Top 0.254: 80.33,33.33 v79.69,33.96
  Top 0.305: 80.33,33.33 VR2.2
  Bottom 0.254: v79.69,33.96 79.69,34.62 U1.7
VR3  (via drill 0.3)
  Top 0.254: 73.92,33.33 v73.29,33.96
  Top 0.305: VR3.2 73.98,33.27 73.92,33.33
  Bottom 0.254: U1.9 74.45,35.48 75.37,35.48 75.63,35.23 75.63,34.47 74.64,33.48 73.82,33.48 73.34,33.96 v73.29,33.96
VR4  (via drill 0.3)
  Top 0.254: 67.56,32.63 v66.36,33.83
  Top 0.305: VR4.2 67.62,32.56 67.56,32.63
  Bottom 0.254: v66.36,33.83 72.27,33.83 73.09,33.02 74.84,33.02 76.77,34.95 76.77,36.37 76.29,36.86 74.38,36.86 U1.11
VR5  (via drill 0.3)
  Top 0.254: VR5.2 61.27,33.33 v60.64,33.96
  Bottom 0.254: U2.5 54.49,36.12 53.66,36.12 53.4,35.87 53.4,33.83 54.04,33.2 59.88,33.2 v60.64,33.96
VR6  (via drill 0.3)
  Top 0.254: 54.92,33.33 v54.29,33.96
  Top 0.305: 54.92,33.33 VR6.2
  Bottom 0.254: v54.29,33.96 54.29,34.62 U2.7
VR7  (via drill 0.3)
  Top 0.254: 48.52,33.33 v47.89,33.96
  Top 0.305: VR7.2 48.58,33.27 48.52,33.33
  Bottom 0.254: U2.9 49.05,35.48 49.97,35.48 50.23,35.23 50.23,34.47 49.23,33.48 48.42,33.48 47.94,33.96 v47.89,33.96
VR8  (via drill 0.3)
  Top 0.254: 42.16,32.63 v40.95,33.83
  Top 0.305: VR8.2 42.23,32.56 42.16,32.63
  Bottom 0.254: v40.95,33.83 46.87,33.83 47.69,33.02 49.44,33.02 51.37,34.95 51.37,36.5 51.01,36.86 48.98,36.86 U2.11
VR9  (via drill 0.3)
  Top 0.254: VR9.2 35.88,33.33 v35.24,33.96
  Bottom 0.254: U3.5 29.09,36.12 28.25,36.12 28,35.87 28,33.83 28.64,33.2 34.48,33.2 v35.24,33.96
VR10  (via drill 0.3)
  Top 0.254: 29.52,33.33 v28.89,33.96
  Top 0.305: 29.52,33.33 VR10.2
  Bottom 0.254: v28.89,33.96 28.89,34.62 U3.7
VR11  (via drill 0.3)
  Top 0.254: 23.12,33.33 v22.49,33.96
  Top 0.305: VR11.2 23.18,33.27 23.12,33.33
  Bottom 0.254: U3.9 23.65,35.48 24.57,35.48 24.83,35.23 24.83,34.47 23.84,33.48 23.02,33.48 22.54,33.96 v22.49,33.96
VR12  (via drill 0.3)
  Top 0.254: 16.76,32.63 v15.55,33.83
  Top 0.305: VR12.2 16.82,32.56 16.76,32.63
  Bottom 0.254: v15.55,33.83 21.47,33.83 22.29,33.02 24.04,33.02 25.97,34.95 25.97,36.37 25.49,36.86 23.57,36.86 U3.11
VR13  (via drill 0.3)
  Top 0.254: VR13.2 86.68,16.82 v86.04,17.45
  Bottom 0.254: U4.5 79.89,19.61 79.06,19.61 78.8,19.36 78.8,17.32 79.44,16.69 85.28,16.69 v86.04,17.45
VR14  (via drill 0.3)
  Top 0.254: 80.33,16.82 v79.69,17.45
  Top 0.305: 80.33,16.82 VR14.2
  Bottom 0.254: v79.69,17.45 79.69,18.11 U4.7
VR15  (via drill 0.3)
  Top 0.254: 73.92,16.82 v73.29,17.45
  Top 0.305: VR15.2 73.98,16.76 73.92,16.82
  Bottom 0.254: U4.9 74.45,18.97 75.37,18.97 75.63,18.72 75.63,17.96 74.64,16.97 73.82,16.97 73.34,17.45 v73.29,17.45
VR16  (via drill 0.3)
  Top 0.254: 67.56,16.12 v66.36,17.32
  Top 0.305: VR16.2 67.62,16.05 67.56,16.12
  Bottom 0.254: v66.36,17.32 72.27,17.32 73.09,16.51 74.84,16.51 76.77,18.44 76.77,19.99 76.41,20.35 74.38,20.35 U4.11
VR17  (via drill 0.3)
  Top 0.254: VR17.2 61.27,16.82 v60.64,17.45
  Bottom 0.254: U5.5 54.49,19.61 53.66,19.61 53.4,19.36 53.4,17.32 54.04,16.69 59.88,16.69 v60.64,17.45
VR18  (via drill 0.3)
  Top 0.254: 54.92,16.82 v54.29,17.45
  Top 0.305: 54.92,16.82 VR18.2
  Bottom 0.254: v54.29,17.45 54.29,18.11 U5.7
VR19  (via drill 0.3)
  Top 0.254: 48.52,16.82 v47.89,17.45
  Top 0.305: VR19.2 48.58,16.76 48.52,16.82
  Bottom 0.254: U5.9 49.05,18.97 49.97,18.97 50.23,18.72 50.23,17.96 49.23,16.97 48.42,16.97 47.94,17.45 v47.89,17.45
VR20  (via drill 0.3)
  Top 0.254: 42.16,16.12 v40.95,17.32
  Top 0.305: VR20.2 42.23,16.05 42.16,16.12
  Bottom 0.254: v40.95,17.32 46.87,17.32 47.69,16.51 49.44,16.51 51.37,18.44 51.37,19.99 51.01,20.35 48.98,20.35 U5.11
VR21  (via drill 0.3)
  Top 0.254: VR21.2 35.88,16.82 v35.24,17.45
  Bottom 0.254: U6.5 29.09,19.61 28.25,19.61 28,19.36 28,17.32 28.64,16.69 34.48,16.69 v35.24,17.45
VR22  (via drill 0.3)
  Top 0.254: 29.52,16.82 v28.89,17.45
  Top 0.305: 29.52,16.82 VR22.2
  Bottom 0.254: v28.89,17.45 28.89,18.11 U6.7
VR23  (via drill 0.3)
  Top 0.254: 23.12,16.82 v22.49,17.45
  Top 0.305: VR23.2 23.18,16.76 23.12,16.82
  Bottom 0.254: U6.9 23.65,18.97 24.57,18.97 24.83,18.72 24.83,17.96 23.84,16.97 23.02,16.97 22.54,17.45 v22.49,17.45
VR24  (via drill 0.3)
  Top 0.254: 16.76,16.12 v15.55,17.32
  Top 0.305: VR24.2 16.82,16.05 16.76,16.12
  Bottom 0.254: v15.55,17.32 21.47,17.32 22.29,16.51 24.04,16.51 25.97,18.44 25.97,19.86 25.49,20.35 23.57,20.35 U6.11

## Text on the board
tPlace: GND | 13 | 12 | 11 | 10 | 9 | 8 | 7 | 6 | 5 | 4 | 3 | 2 | 1 | 0 | TX3 | RX3 | TX2 | RX2 | TX1 | RX1 | SDA | SCL | 33 | 32 | 31 | 30 | 29 | 28 | 27 | 26 | 25 | 24 | 23 | 22 | TX | RX | EN | 45 | 44 | 43 | 42 | 41 | 40 | 39 | 38 | 37 | 36 | 35 | 34 | 5V / 22 / 24 / 26 / 28 / 30 / 32 / 34 / 36 / 38 / 40 / 42 / 44 / 46 / 48 | 0 / 1 / 2 / 3 / 4 / 5 / 6 / 7 | - + S | 5V / 23 / 25 / 27 / 29 / 31 / 33 / 35 / 37 / 39 / 41 / 43 / 45 / 47 / 49 / 51 / 53 | 12V | 5V | 3.3V / 5V / GND / GND / Vin | Jim-DCC / Command Center / 160619V1